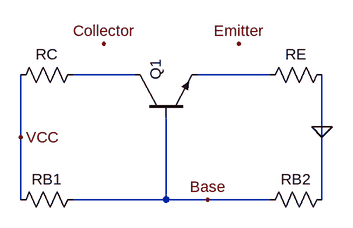
[diagram p0: schematic Draft2.asc]
Draft2.asc, the LTspice schematic file:
Version 4
SHEET 1 880 680
WIRE 240 80 144 80
WIRE 448 80 336 80
WIRE 528 160 528 80
WIRE 64 176 64 80
WIRE 64 272 64 176
WIRE 288 272 288 144
WIRE 288 272 144 272
WIRE 352 272 288 272
WIRE 448 272 352 272
WIRE 528 272 528 160
FLAG 64 176 VCC
FLAG 528 160 0
FLAG 192 32 Collector
FLAG 400 32 Emitter
FLAG 352 272 Base
SYMBOL res 48 96 R270
WINDOW 0 32 56 VTop 2
WINDOW 3 0 56 VBottom 2
SYMATTR InstName RC
SYMATTR Value ""
SYMBOL res 432 96 R270
WINDOW 0 32 56 VTop 2
WINDOW 3 0 56 VBottom 2
SYMATTR InstName RE
SYMATTR Value ""
SYMBOL res 432 288 R270
WINDOW 0 32 56 VTop 2
WINDOW 3 0 56 VBottom 2
SYMATTR InstName RB2
SYMATTR Value ""
SYMBOL res 48 288 R270
WINDOW 0 32 56 VTop 2
WINDOW 3 0 56 VBottom 2
SYMATTR InstName RB1
SYMATTR Value ""
SYMBOL npn 240 144 R270
SYMATTR InstName Q1
SYMATTR Value ""

The netlist it stands for:
* Draft2.asc
RC VCC N001
RE N002 0
RB2 Base 0
RB1 VCC Base
Q1 N001 Base N002 0
.model NPN NPN
.model PNP PNP
.lib standard.bjt
.backanno
.end